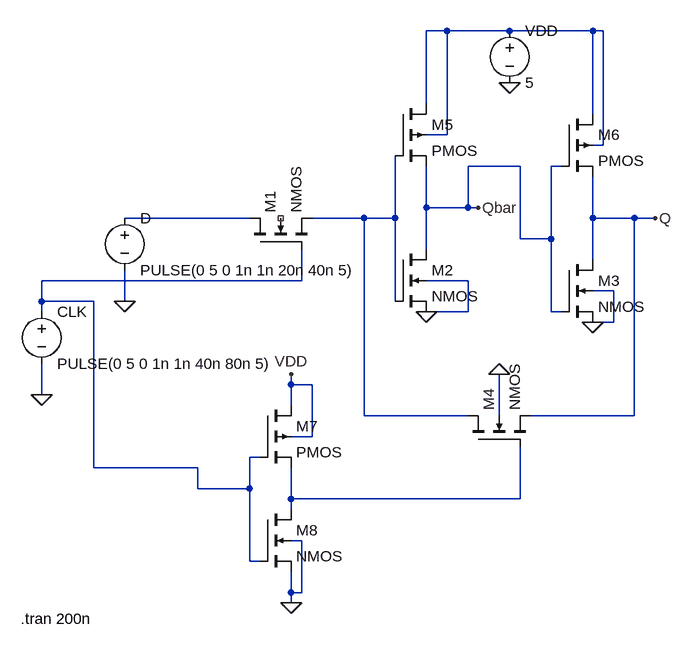
[diagram p0: schematic D flipflop.asc]
D flipflop.asc, the LTspice schematic file:
Version 4.1
SHEET 1 880 744
WIRE 320 -176 288 -176
WIRE 416 -176 320 -176
WIRE 544 -176 416 -176
WIRE 560 -176 544 -176
WIRE 288 -64 288 -176
WIRE 544 -48 544 -176
WIRE 320 -16 320 -176
WIRE 320 -16 288 -16
WIRE 560 0 560 -176
WIRE 560 0 544 0
WIRE 432 32 352 32
WIRE 496 32 480 32
WIRE 288 96 288 32
WIRE 352 96 352 32
WIRE 352 96 288 96
WIRE 368 96 352 96
WIRE 16 112 -176 112
WIRE 192 112 112 112
WIRE 240 112 240 16
WIRE 240 112 192 112
WIRE 544 112 544 48
WIRE 608 112 544 112
WIRE 640 112 608 112
WIRE 432 144 432 32
WIRE 480 144 480 32
WIRE 480 144 432 144
WIRE 288 160 288 96
WIRE 544 176 544 112
WIRE 96 208 96 160
WIRE 96 208 -304 208
WIRE 352 208 288 208
WIRE 576 224 544 224
WIRE -304 240 -304 208
WIRE -224 240 -304 240
WIRE -176 240 -176 192
WIRE 240 240 240 112
WIRE -304 256 -304 240
WIRE 352 256 352 208
WIRE 352 256 288 256
WIRE 480 256 480 144
WIRE 496 256 480 256
WIRE 576 272 576 224
WIRE 576 272 544 272
WIRE 80 368 80 352
WIRE 112 368 80 368
WIRE -304 384 -304 336
WIRE 80 400 80 368
WIRE 192 416 192 112
WIRE 352 416 192 416
WIRE 400 416 400 352
WIRE 608 416 608 112
WIRE 608 416 448 416
WIRE 112 448 112 368
WIRE 112 448 80 448
WIRE 32 480 16 480
WIRE -224 496 -224 240
WIRE -64 496 -224 496
WIRE -64 528 -64 496
WIRE 16 528 16 480
WIRE 16 528 -64 528
WIRE 80 544 80 496
WIRE 432 544 432 464
WIRE 432 544 80 544
WIRE 80 560 80 544
WIRE 96 608 80 608
WIRE 16 640 16 528
WIRE 32 640 16 640
WIRE 80 688 80 656
WIRE 96 688 96 608
WIRE 96 688 80 688
WIRE 80 704 80 688
FLAG 368 96 Qbar
FLAG 640 112 Q
FLAG 416 -96 0
FLAG 288 256 0
FLAG 544 272 0
FLAG -176 240 0
FLAG -304 384 0
FLAG 400 352 0
FLAG 80 352 VDD
FLAG 80 704 0
SYMBOL nmos4 16 160 R270
SYMATTR InstName M1
SYMBOL nmos4 240 160 R0
SYMATTR InstName M2
SYMBOL nmos4 496 176 R0
SYMATTR InstName M3
SYMBOL nmos4 352 464 R270
SYMATTR InstName M4
SYMBOL pmos4 240 -64 R0
SYMATTR InstName M5
SYMBOL pmos4 496 -48 R0
SYMATTR InstName M6
SYMBOL voltage 416 -192 R0
WINDOW 123 0 0 Left 0
WINDOW 39 0 0 Left 0
SYMATTR InstName VDD
SYMATTR Value 5
SYMBOL voltage -176 96 R0
WINDOW 123 0 0 Left 0
WINDOW 39 0 0 Left 0
SYMATTR InstName D
SYMATTR Value PULSE(0 5 0 1n 1n 20n 40n 5)
SYMBOL voltage -304 240 R0
WINDOW 123 0 0 Left 0
WINDOW 39 0 0 Left 0
SYMATTR InstName CLK
SYMATTR Value PULSE(0 5 0 1n 1n 40n 80n 5)
SYMBOL pmos4 32 400 R0
SYMATTR InstName M7
SYMBOL nmos4 32 560 R0
SYMATTR InstName M8
TEXT -336 728 Left 2 !.tran 200n

The netlist it stands for:
* D flipflop.asc
M1 N002 N004 N003 NC_01 NMOS
M2 Qbar N003 0 0 NMOS
M3 Q Qbar 0 0 NMOS
M4 N003 N005 Q 0 NMOS
M5 N001 N003 Qbar N001 PMOS
M6 N001 Qbar Q N001 PMOS
VDD N001 0 5
V§D N002 0 PULSE(0 5 0 1n 1n 20n 40n 5)
V§CLK N004 0 PULSE(0 5 0 1n 1n 40n 80n 5)
M7 VDD N004 N005 VDD PMOS
M8 N005 N004 0 0 NMOS
.model NMOS NMOS
.model PMOS PMOS
.lib standard.mos
.tran 200n
.backanno
.end